# EAGLE design lm324am_voltage (EAGLE 9.2.1)
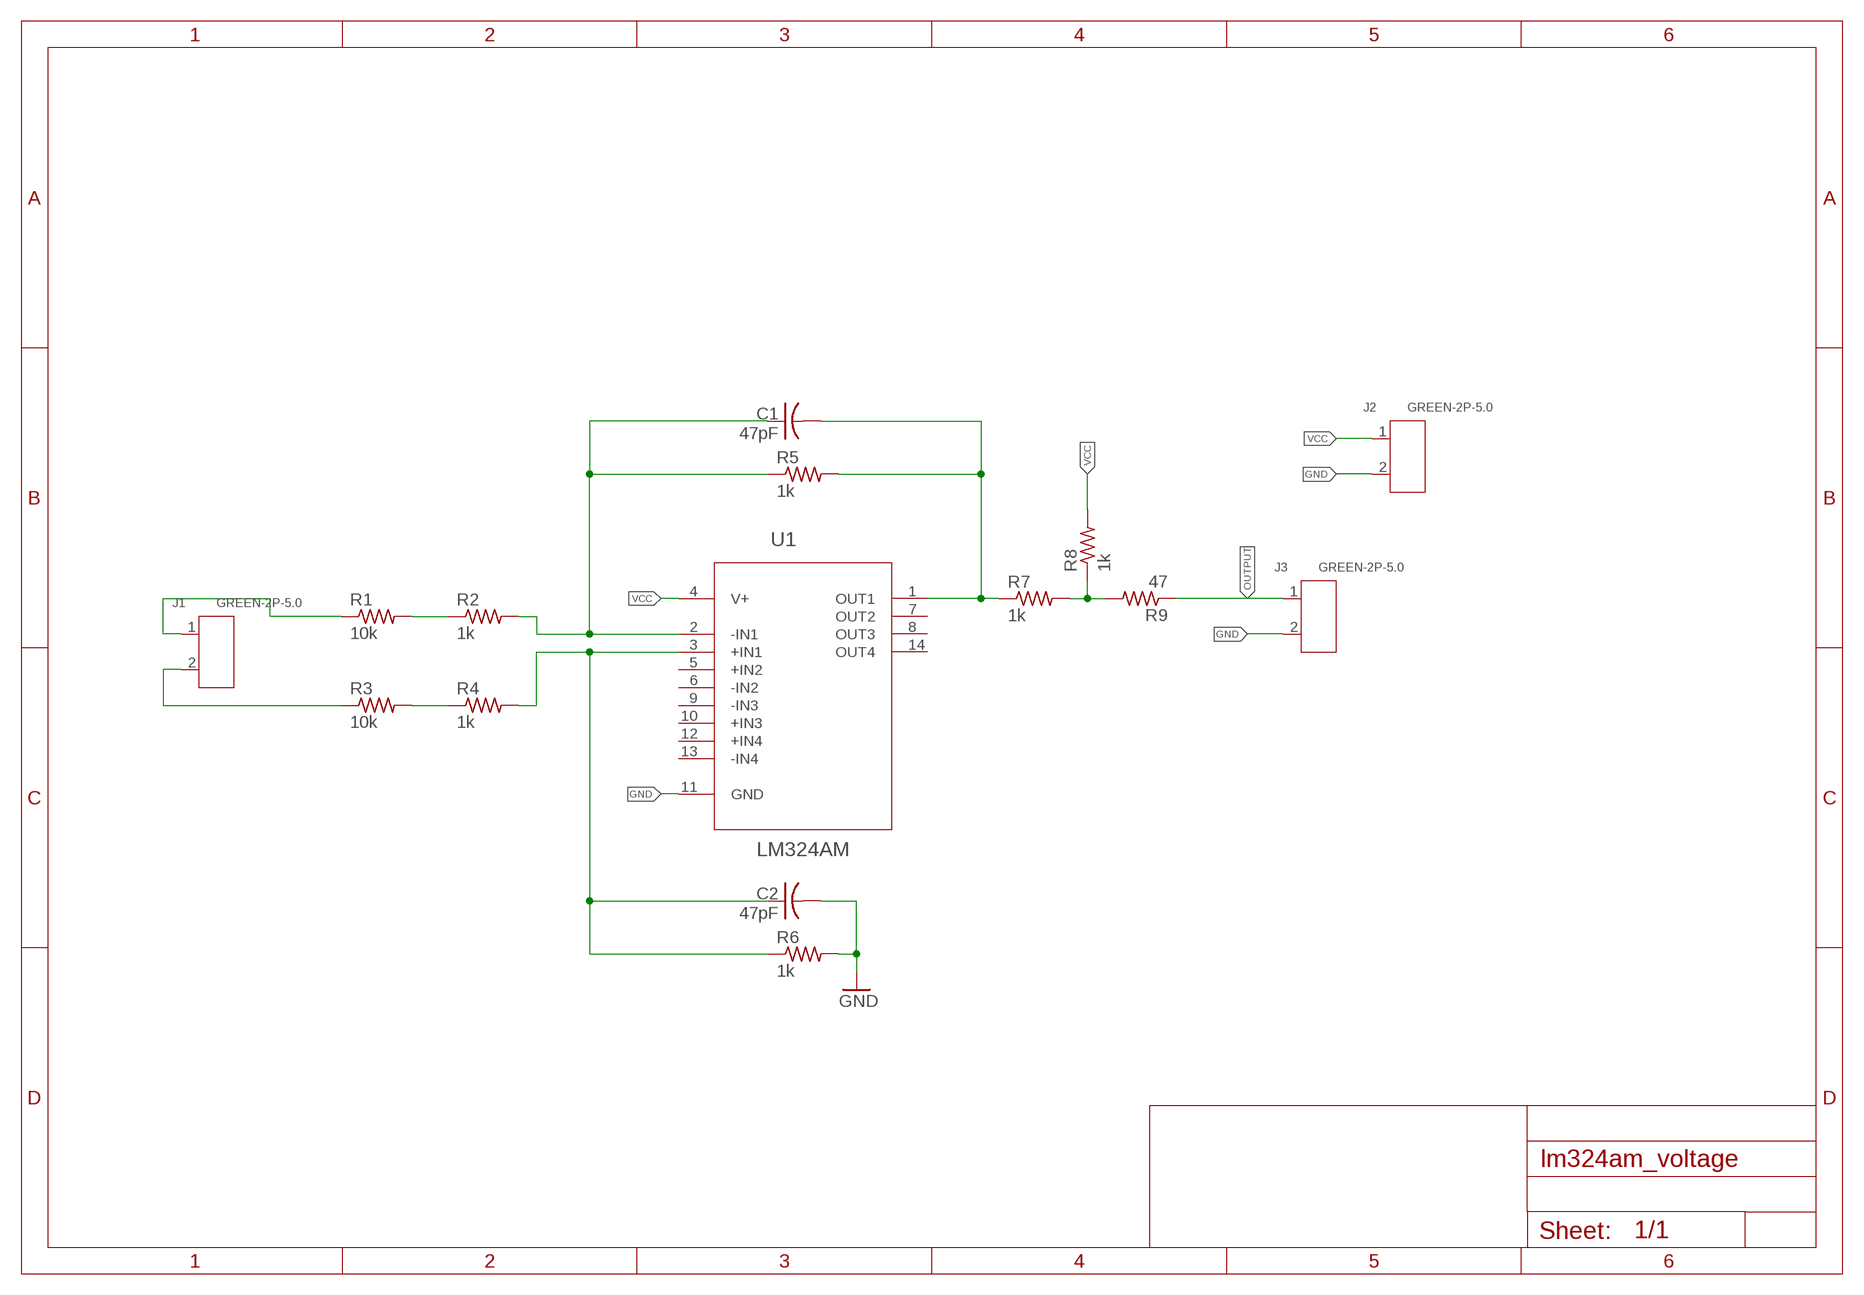
[diagram p0: schematic, sheet 1]

## Parts
C1  47pF  C-USC1206  [C1206]
C2  47pF  C-USC1206  [C1206]
J1  GREEN-2P-5.0  SCREW-TERMINAL-GREEN(2P-5.0)  [H2-5.0-10.5X8.0MM]
J2  GREEN-2P-5.0  SCREW-TERMINAL-GREEN(2P-5.0)  [H2-5.0-10.5X8.0MM]
J3  GREEN-2P-5.0  SCREW-TERMINAL-GREEN(2P-5.0)  [H2-5.0-10.5X8.0MM]
R1  10k  R-US_M1206  [M1206]
R2  1k  R-US_M1206  [M1206]
R3  10k  R-US_M1206  [M1206]
R4  1k  R-US_M1206  [M1206]
R5  1k  R-US_M1206  [M1206]
R6  1k  R-US_M1206  [M1206]
R7  1k  R-US_M1206  [M1206]
R8  1k  R-US_M1206  [M1206]
R9  47  R-US_M1206  [M1206]
U1  LM324AM  [SOIC127P620X175-14N]

## Nets
GND: C2.2 J2.2 J3.2 R6.2 U1.11(GND)
N$2: J1.2 R3.1
N$3: R3.2 R4.1
N$4: R1.2 R2.1
N$5: C1.1 R2.2 R5.1 U1.2(-IN1)
N$6: C2.1 R4.2 R6.1 U1.3(+IN1)
N$7: C1.2 R5.2 R7.1 U1.1(OUT1)
N$8: R7.2 R8.1 R9.2
N$11: J1.1 R1.1
OUTPUT: J3.1 R9.1
VCC: J2.1 R8.2 U1.4(V+)
Unconnected: U1.5(+IN2) U1.6(-IN2) U1.7(OUT2) U1.8(OUT3) U1.9(-IN3) U1.10(+IN3) U1.12(+IN4) U1.13(-IN4) U1.14(OUT4)

## Library data of the parts
C1 C2 = rcl:C-US: CAPACITOR, American symbol; SPICEPREFIX: C
J1-J3 = Seeed-Connector:SCREW-TERMINAL-GREEN(2P-5.0): 320110031
R1-R9 = rcl:R-US_: RESISTOR, American symbol; SPICEPREFIX: R
U1 = LM324AM:LM324AM: Low Power Quad Operational Amplifiers; AVAILABILITY: Unavailable; DESCRIPTION: 14 pin Low Power Quad Operational Amplifier 55 per tube; MF: Texas Instruments; MP: LM324AM; PACKAGE: SOIC-14 ON; PRICE: None

## Board
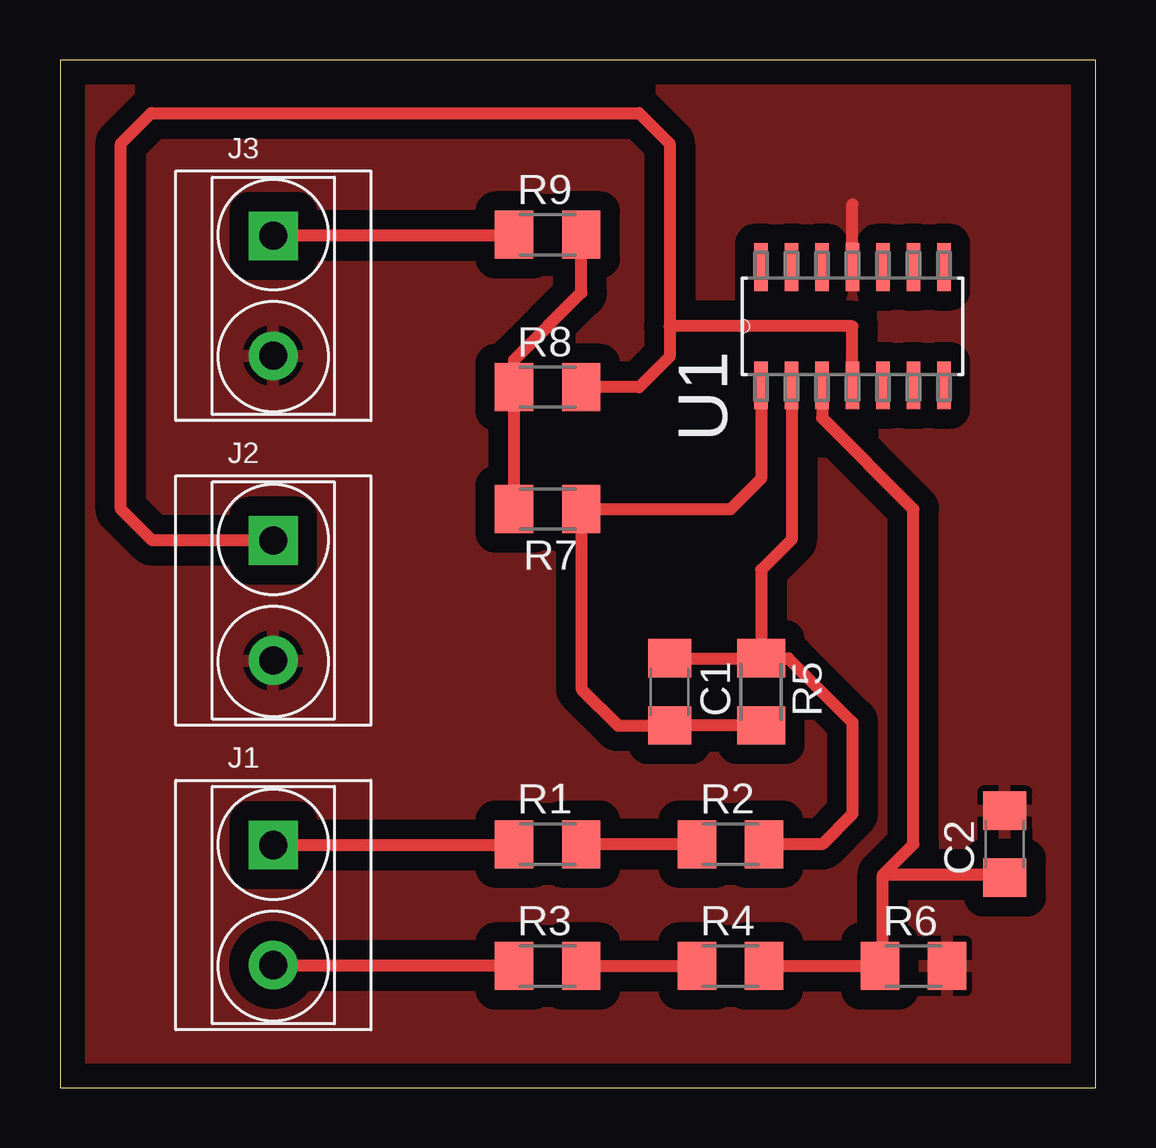
[diagram p1: board, top side]

Size 43.16 x 42.85 mm. Coordinates in mm from the lower left corner, seen from the top.
Outline: 0,0 43.16,0 43.16,42.85 0,42.85 0,0
Copper layers (1*16): Top 0.035mm / dielectric 1.5mm / Bottom 0.035mm
Design rules "default": minimum track width 6mil, minimum drill 0.35mm, track to track 6mil, track to pad 6mil, pad to pad 6mil, via to via 6mil, smd to smd 6mil, copper to edge 40mil, drill to drill 6mil, minimum pad ring 10mil, minimum via ring 8mil, stop-mask expansion 4mil, vias tented up to drill 0mil, thermal gap 10mil

### Footprints (pad centres in the part's own frame; a part is rotated, then mirrored left to right if it is on the bottom)
C1206 = smd 1.6 x 1.8: 1 -1.4,0; 2 1.4,0
H2-5.0-10.5X8.0MM = drill 1.168 pad 2.032 square: 1 0,2.5 | drill 1.168 pad 2.032: 2 0,-2.5
M1206 = smd 1.6 x 2: 1 -1.4,0; 2 1.4,0
SOIC127P620X175-14N = smd 1.981 x 0.559: 1 -2.464,3.81; 2 -2.464,2.54; 3 -2.464,1.27; 4 -2.464,0; 5 -2.464,-1.27; 6 -2.464,-2.54; 7 -2.464,-3.81; 8 2.464,-3.81; 9 2.464,-2.54; 10 2.464,-1.27; 11 2.464,0; 12 2.464,1.27; 13 2.464,2.54; 14 2.464,3.81

### Placement (x,y rotation side)
C1  25.4,16.51 270 top
C2  39.37,10.16 90 top
J1  8.89,7.62 0 top
J2  8.89,20.32 0 top
J3  8.89,33.02 0 top
R1  20.32,10.16 0 top
R2  27.94,10.16 0 top
R3  20.32,5.08 0 top
R4  27.94,5.08 0 top
R5  29.21,16.51 270 top
R6  35.56,5.08 0 top
R7  20.32,24.13 180 top
R8  20.32,29.21 0 top
R9  20.32,35.56 0 top
U1  33.02,31.75 90 top

### Tracks (layer width: path | path; a pad name or v marks a point on that pad's centre or on a via)
GND
  Top 0.508: U1.11 33.02,36.83
  pour Top: 54.61,-5.08 53.34,-6.35 -11.43,-6.35
  pour Top (isolate 0.813): 1.27,41.91 43.18,41.91 43.18,0 1.27,0
N$2
  Top 0.508: J1.2 19.01,5.12 19.05,5.08 R3.1
N$3
  Top 0.508: R3.2 R4.1
N$4
  Top 0.508: R2.1 R1.2
N$5
  Top 0.508: C1.1 R5.1 | U1.2 30.48,22.86 29.21,21.59 R5.1 | R5.1 30.35,17.91 33.02,15.24 33.02,11.43 31.75,10.16 R2.2
N$6
  Top 0.508: R4.2 R6.1 34.29,5.21 34.29,8.89 | 34.29,8.89 35.56,10.16 35.56,24.13 31.75,27.94 U1.3 | C2.1 39.24,8.89 34.29,8.89
N$7
  Top 0.508: U1.1 29.21,25.4 27.94,24.13 R7.1 21.72,16.64 23.25,15.11 C1.2 | 28.59,15.11 28.6,15.1 R5.2 C1.2 | C1.2 25.27,15.24
N$8
  Top 0.508: R7.2 R8.1 18.92,30.35 21.72,33.15 R9.2
N$11
  Top 0.508: R1.1 18.88,10.12 J1.1
OUTPUT
  Top 0.508: R9.1 18.88,35.52 J3.1
VCC
  Top 0.508: J2.1 3.85,22.82 2.54,24.13 2.54,39.37 3.81,40.64 24.13,40.64 25.4,39.37 25.4,31.75 | R8.2 24.13,29.21 25.4,30.48 25.4,31.75 | U1.4 33.02,31.75 25.4,31.75